# EAGLE design schematic (EAGLE 6.5.0)
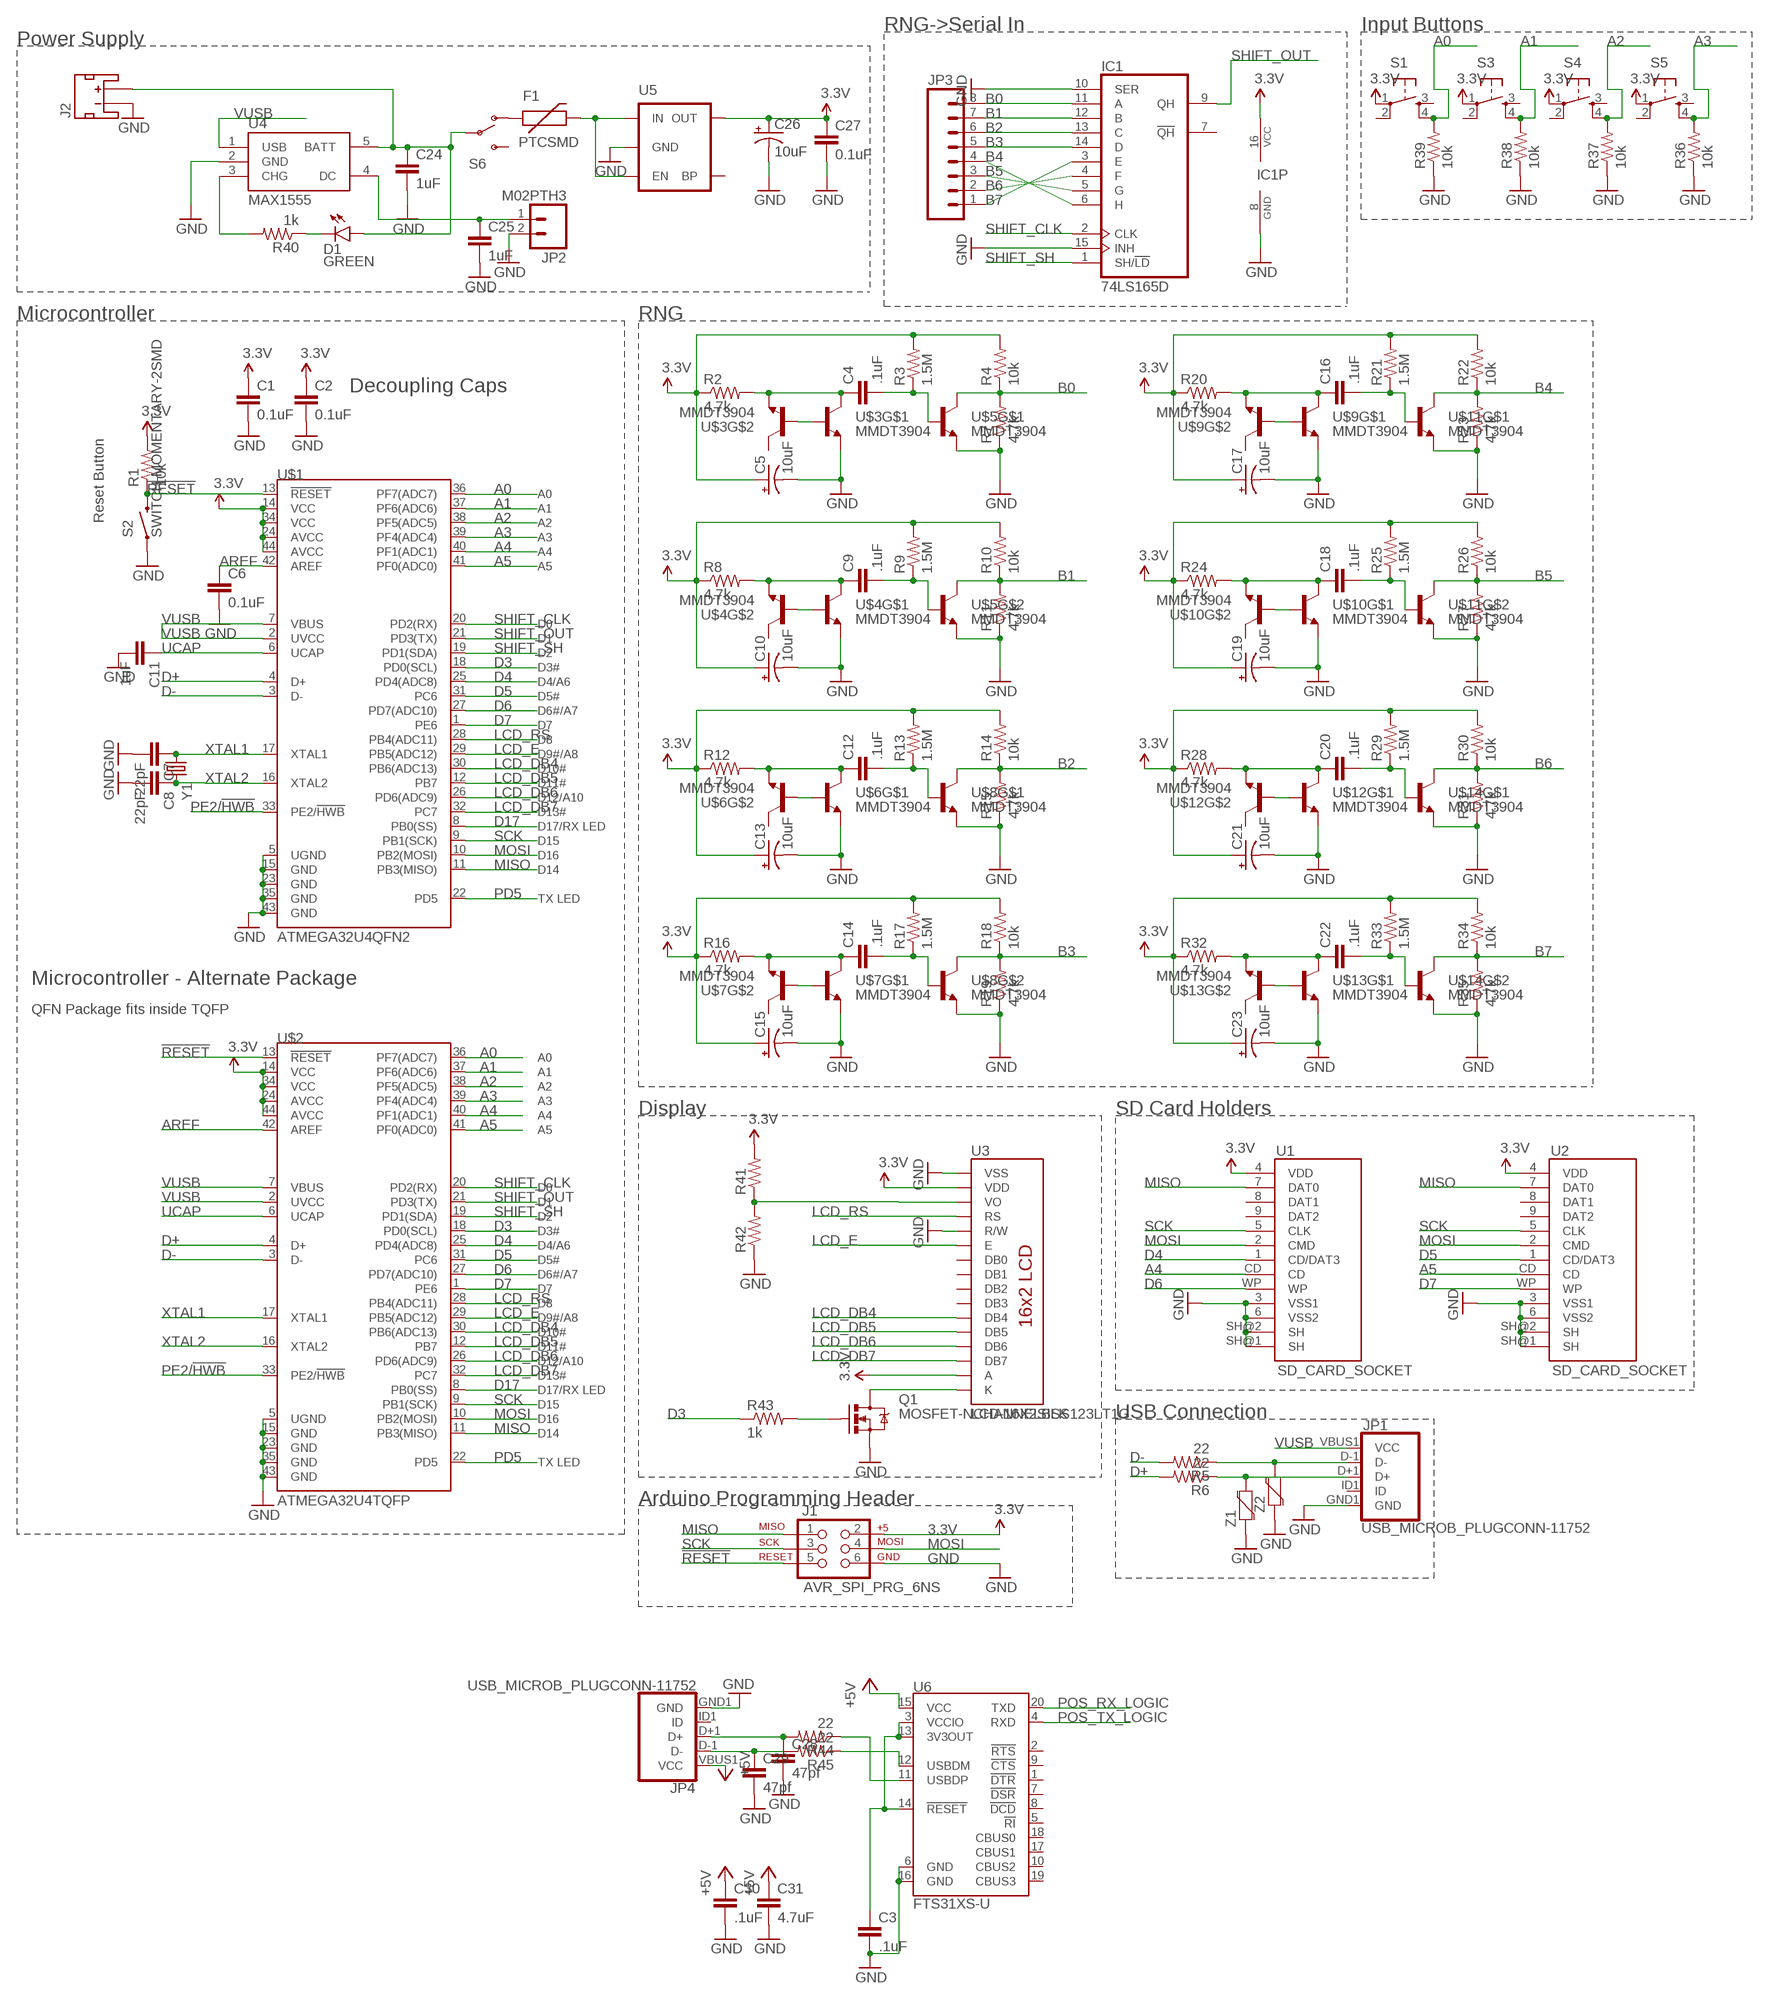
[diagram p0: schematic, sheet 1]

## Parts
C1  0.1uF  CAP0603-CAP  [0603-CAP]
C2  0.1uF  CAP0603-CAP  [0603-CAP]
C3  .1uF  CAP0603-CAP  [0603-CAP]
C4  .1uF  CAP0603-CAP  [0603-CAP]
C5  10uF  CAP_POL1206  [EIA3216]
C6  0.1uF  CAP0603-CAP  [0603-CAP]
C7  22pF  CAP0603-CAP  [0603-CAP]
C8  22pF  CAP0603-CAP  [0603-CAP]
C9  .1uF  CAP0603-CAP  [0603-CAP]
C10  10uF  CAP_POL1206  [EIA3216]
C11  1uF  CAP0603-CAP  [0603-CAP]
C12  .1uF  CAP0603-CAP  [0603-CAP]
C13  10uF  CAP_POL1206  [EIA3216]
C14  .1uF  CAP0603-CAP  [0603-CAP]
C15  10uF  CAP_POL1206  [EIA3216]
C16  .1uF  CAP0603-CAP  [0603-CAP]
C17  10uF  CAP_POL1206  [EIA3216]
C18  .1uF  CAP0603-CAP  [0603-CAP]
C19  10uF  CAP_POL1206  [EIA3216]
C20  .1uF  CAP0603-CAP  [0603-CAP]
C21  10uF  CAP_POL1206  [EIA3216]
C22  .1uF  CAP0603-CAP  [0603-CAP]
C23  10uF  CAP_POL1206  [EIA3216]
C24  1uF  CAP0603-CAP  [0603-CAP]
C25  1uF  CAP0603-CAP  [0603-CAP]
C26  10uF  CAP_POL1206  [EIA3216]
C27  0.1uF  CAP0603-CAP  [0603-CAP]
C28  47pf  CAP0603-CAP  [0603-CAP]
C29  47pf  CAP0603-CAP  [0603-CAP]
C30  .1uF  CAP0603-CAP  [0603-CAP]
C31  4.7uF  CAP0603-CAP  [0603-CAP]
D1  GREEN  LED-GREEN0603  [LED-0603]
F1  PTCSMD  [PTC-1206]
IC1  74LS165D  [SO16]
J1  AVR_SPI_PRG_6NS  [2X3-NS]
J2  JST_2MM_MALE  [JST-2-SMD]
JP1  USB_MICROB_PLUGCONN-11752  [USB-B-MICRO-SMD_V03]
JP2  M02PTH3  [1X02_LONGPADS]
JP3  M081X08  [1X08]
JP4  USB_MICROB_PLUGCONN-11752  [USB-B-MICRO-SMD_V03]
Q1  MOSFET-NCHANNELBSS123LT1G  [SOT23]
R1  10k  RESISTOR0603-RES  [0603-RES]
R2  4.7k  RESISTOR0603-RES  [0603-RES]
R3  1.5M  RESISTOR0603-RES  [0603-RES]
R4  10k  RESISTOR0603-RES  [0603-RES]
R5  22  RESISTOR0603-RES  [0603-RES]
R6  22  RESISTOR0603-RES  [0603-RES]
R7  4.7k  RESISTOR0603-RES  [0603-RES]
R8  4.7k  RESISTOR0603-RES  [0603-RES]
R9  1.5M  RESISTOR0603-RES  [0603-RES]
R10  10k  RESISTOR0603-RES  [0603-RES]
R11  4.7k  RESISTOR0603-RES  [0603-RES]
R12  4.7k  RESISTOR0603-RES  [0603-RES]
R13  1.5M  RESISTOR0603-RES  [0603-RES]
R14  10k  RESISTOR0603-RES  [0603-RES]
R15  4.7k  RESISTOR0603-RES  [0603-RES]
R16  4.7k  RESISTOR0603-RES  [0603-RES]
R17  1.5M  RESISTOR0603-RES  [0603-RES]
R18  10k  RESISTOR0603-RES  [0603-RES]
R19  4.7k  RESISTOR0603-RES  [0603-RES]
R20  4.7k  RESISTOR0603-RES  [0603-RES]
R21  1.5M  RESISTOR0603-RES  [0603-RES]
R22  10k  RESISTOR0603-RES  [0603-RES]
R23  4.7k  RESISTOR0603-RES  [0603-RES]
R24  4.7k  RESISTOR0603-RES  [0603-RES]
R25  1.5M  RESISTOR0603-RES  [0603-RES]
R26  10k  RESISTOR0603-RES  [0603-RES]
R27  4.7k  RESISTOR0603-RES  [0603-RES]
R28  4.7k  RESISTOR0603-RES  [0603-RES]
R29  1.5M  RESISTOR0603-RES  [0603-RES]
R30  10k  RESISTOR0603-RES  [0603-RES]
R31  4.7k  RESISTOR0603-RES  [0603-RES]
R32  4.7k  RESISTOR0603-RES  [0603-RES]
R33  1.5M  RESISTOR0603-RES  [0603-RES]
R34  10k  RESISTOR0603-RES  [0603-RES]
R35  4.7k  RESISTOR0603-RES  [0603-RES]
R36  10k  RESISTOR0603-RES  [0603-RES]
R37  10k  RESISTOR0603-RES  [0603-RES]
R38  10k  RESISTOR0603-RES  [0603-RES]
R39  10k  RESISTOR0603-RES  [0603-RES]
R40  1k  RESISTOR0603-RES  [0603-RES]
R41  RESISTOR0603-RES  [0603-RES]
R42  RESISTOR0603-RES  [0603-RES]
R43  1k  RESISTOR0603-RES  [0603-RES]
R44  22  RESISTOR0603-RES  [0603-RES]
R45  22  RESISTOR0603-RES  [0603-RES]
S1  TAC_SWITCHPTH  [TACTILE-PTH]
S2  SWITCH-MOMENTARY-2SMD  [TACTILE-SWITCH-SMD]
S3  TAC_SWITCHPTH  [TACTILE-PTH]
S4  TAC_SWITCHPTH  [TACTILE-PTH]
S5  TAC_SWITCHPTH  [TACTILE-PTH]
S6  SWITCH-SPDTPTH  [SWITCH-SPDT]
U1  SD_CARD_SOCKET  [SD_1:1]
U2  SD_CARD_SOCKET  [SD_1:1]
U3  LCD-16X2SILK  [LCD-16X2]
U4  MAX1555  [SOT23-5]
U5  MIC52053.3V  [SOT23-5]
U6  FTS31XS-U  FT231XS  [SSOP20_L]
U$1  ATMEGA32U4QFN2  [SPARKFUN-DIGITALIC_QFN-44-NOPAD]
U$2  ATMEGA32U4TQFP  [SPARKFUN-DIGITALIC_TQFP44]
U$3  MMDT3904  TRANSISTOR_NPN2UPMMDT3904  [SOT363]
U$4  MMDT3904  TRANSISTOR_NPN2UPMMDT3904  [SOT363]
U$5  MMDT3904  TRANSISTOR_NPN2UPMMDT3904  [SOT363]
U$6  MMDT3904  TRANSISTOR_NPN2UPMMDT3904  [SOT363]
U$7  MMDT3904  TRANSISTOR_NPN2UPMMDT3904  [SOT363]
U$8  MMDT3904  TRANSISTOR_NPN2UPMMDT3904  [SOT363]
U$9  MMDT3904  TRANSISTOR_NPN2UPMMDT3904  [SOT363]
U$10  MMDT3904  TRANSISTOR_NPN2UPMMDT3904  [SOT363]
U$11  MMDT3904  TRANSISTOR_NPN2UPMMDT3904  [SOT363]
U$12  MMDT3904  TRANSISTOR_NPN2UPMMDT3904  [SOT363]
U$13  MMDT3904  TRANSISTOR_NPN2UPMMDT3904  [SOT363]
U$14  MMDT3904  TRANSISTOR_NPN2UPMMDT3904  [SOT363]
Y1  CRYSTALSMD  [HC49UP]
Z1  VARISTOR-0603  [0603-RES]
Z2  VARISTOR-0603  [0603-RES]

## Nets
3.3V: C1.1 C2.1 C5.A(+) C10.A(+) C13.A(+) C15.A(+) C17.A(+) C19.A(+) C21.A(+) C23.A(+) C26.A(+) C27.1 IC1.16(VCC) J1.2 R1.2 R2.1 R3.2 R4.2 R8.1 R9.2 R10.2 R12.1 R13.2 R14.2 R16.1 R17.2 R18.2 R20.1 R21.2 R22.2 R24.1 R25.2 R26.2 R28.1 R29.2 R30.2 R32.1 R33.2 R34.2 R41.2 S1.1 S3.1 S4.1 S5.1 U1.4(VDD) U2.4(VDD) U3.2(VDD) U3.15(A) U5.5(OUT) U$1.14(VCC) U$1.24(AVCC) U$1.34(VCC) U$1.44(AVCC) U$2.14(VCC) U$2.24(AVCC) U$2.34(VCC) U$2.44(AVCC)
!RESET: J1.5 R1.1 S2.3 U$1.13(!RESET) U$2.13(!RESET)
+5V: C30.1 C31.1 JP4.VBUS1(VCC) U6.15(VCC)
A0: R39.2 S1.4 U$1.36(PF7(ADC7)) U$2.36(PF7(ADC7))
A1: R38.2 S3.4 U$1.37(PF6(ADC6)) U$2.37(PF6(ADC6))
A2: R37.2 S4.4 U$1.38(PF5(ADC5)) U$2.38(PF5(ADC5))
A3: R36.2 S5.4 U$1.39(PF4(ADC4)) U$2.39(PF4(ADC4))
A4: U1.CD U$1.40(PF1(ADC1)) U$2.40(PF1(ADC1))
A5: U2.CD U$1.41(PF0(ADC0)) U$2.41(PF0(ADC0))
AREF: C6.1 U$1.42(AREF) U$2.42(AREF)
B0: IC1.11(A) JP3.8 R4.1 R7.2 U$5.6(C)
B1: IC1.12(B) JP3.7 R10.1 R11.2 U$5.3(C)
B2: IC1.13(C) JP3.6 R14.1 R15.2 U$8.6(C)
B3: IC1.14(D) JP3.5 R18.1 R19.2 U$8.3(C)
B4: IC1.3(E) JP3.1 R22.1 R23.2 U$11.6(C)
B5: IC1.4(F) JP3.2 R26.1 R27.2 U$11.3(C)
B6: IC1.5(G) JP3.3 R30.1 R31.2 U$14.6(C)
B7: IC1.6(H) JP3.4 R34.1 R35.2 U$14.3(C)
D3: R43.1 U$1.18(PD0(SCL)) U$2.18(PD0(SCL))
D4: U1.1(CD/DAT3) U$1.25(PD4(ADC8)) U$2.25(PD4(ADC8))
D5: U2.1(CD/DAT3) U$1.31(PC6) U$2.31(PC6)
D6: U1.WP U$1.27(PD7(ADC10)) U$2.27(PD7(ADC10))
D7: U2.WP U$1.1(PE6) U$2.1(PE6)
D17: U$1.8(PB0(SS)) U$2.8(PB0(SS))
D+: R6.2 U$1.4(D+) U$2.4(D+)
D-: R5.2 U$1.3(D-) U$2.3(D-)
GND: C1.2 C2.2 C3.2 C5.C(-) C6.2 C7.2 C8.2 C10.C(-) C11.2 C13.C(-) C15.C(-) C17.C(-) C19.C(-) C21.C(-) C23.C(-) C24.2 C25.2 C26.C(-) C27.2 C28.2 C29.2 C30.2 C31.2 IC1.8(GND) IC1.10(SER) IC1.15(INH) J1.6 J2.1(-) JP1.GND1(GND) JP2.2 JP4.GND1(GND) Q1.2(S) R7.1 R11.1 R15.1 R19.1 R23.1 R27.1 R31.1 R35.1 R36.1 R37.1 R38.1 R39.1 R42.1 S2.1 U1.3(VSS1) U1.6(VSS2) U1.SH@1(SH) U1.SH@2(SH) U2.3(VSS1) U2.6(VSS2) U2.SH@1(SH) U2.SH@2(SH) U3.1(VSS) U3.5(R/W) U4.2(GND) U5.2(GND) U6.6(GND) U6.16(GND) U$1.5(UGND) U$1.15(GND) U$1.23(GND) U$1.35(GND) U$1.43(GND) U$2.5(UGND) U$2.15(GND) U$2.23(GND) U$2.35(GND) U$2.43(GND) U$3.1(E) U$4.1(E) U$5.1(E) U$5.4(E) U$6.1(E) U$7.1(E) U$8.1(E) U$8.4(E) U$9.1(E) U$10.1(E) U$11.1(E) U$11.4(E) U$12.1(E) U$13.1(E) U$14.1(E) U$14.4(E) Z1.1 Z2.1
LCD_DB4: U3.11(DB4) U$1.30(PB6(ADC13)) U$2.30(PB6(ADC13))
LCD_DB5: U3.12(DB5) U$1.12(PB7) U$2.12(PB7)
LCD_DB6: U3.13(DB6) U$1.26(PD6(ADC9)) U$2.26(PD6(ADC9))
LCD_DB7: U3.14(DB7) U$1.32(PC7) U$2.32(PC7)
LCD_E: U3.6(E) U$1.29(PB5(ADC12)) U$2.29(PB5(ADC12))
LCD_RS: U3.4(RS) U$1.28(PB4(ADC11)) U$2.28(PB4(ADC11))
MISO: J1.1 U1.7(DAT0) U2.7(DAT0) U$1.11(PB3(MISO)) U$2.11(PB3(MISO))
MOSI: J1.4 U1.2(CMD) U2.2(CMD) U$1.10(PB2(MOSI)) U$2.10(PB2(MOSI))
N$1: U$3.2(B) U$3.5(B)
N$2: C4.1 R2.2 U$3.4(E) U$3.6(C)
N$3: C24.1 D1.A J2.2(+) S6.2(P) U4.5(BATT)
N$4: C4.2 R3.1 U$5.2(B)
N$5: U$4.2(B) U$4.5(B)
N$6: C9.1 R8.2 U$4.4(E) U$4.6(C)
N$7: C9.2 R9.1 U$5.5(B)
N$8: C25.1 JP2.1 U4.4(DC)
N$9: U$6.2(B) U$6.5(B)
N$10: C12.1 R12.2 U$6.4(E) U$6.6(C)
N$11: C12.2 R13.1 U$8.2(B)
N$12: F1.1 S6.1(O)
N$13: U$7.2(B) U$7.5(B)
N$14: C14.1 R16.2 U$7.4(E) U$7.6(C)
N$15: C14.2 R17.1 U$8.5(B)
N$16: R40.2 U4.3(CHG)
N$17: U$9.2(B) U$9.5(B)
N$18: C16.1 R20.2 U$9.4(E) U$9.6(C)
N$19: C16.2 R21.1 U$11.2(B)
N$20: D1.C R40.1
N$21: Q1.1(G) R43.2
N$22: C28.1 JP4.D+1(D+) R44.2
N$23: C29.1 JP4.D-1(D-) R45.2
N$24: U$10.2(B) U$10.5(B)
N$25: C18.1 R24.2 U$10.4(E) U$10.6(C)
N$26: JP1.D-1(D-) R5.1 Z2.2
N$27: JP1.D+1(D+) R6.1 Z1.2
N$28: C18.2 R25.1 U$11.5(B)
N$29: Q1.3(D) U3.16(K)
N$30: U$12.2(B) U$12.5(B)
N$31: C20.1 R28.2 U$12.4(E) U$12.6(C)
N$32: C20.2 R29.1 U$14.2(B)
N$33: F1.2 U5.1(IN) U5.3(EN)
N$34: U$13.2(B) U$13.5(B)
N$35: C22.1 R32.2 U$13.4(E) U$13.6(C)
N$36: C22.2 R33.1 U$14.5(B)
N$37: R44.1 U6.11(USBDP)
N$38: R45.1 U6.12(USBDM)
N$39: R41.1 R42.2 U3.3(VO)
N$40: C3.1 U6.3(VCCIO) U6.13(3V3OUT) U6.14(!RESET)
PD5: U$1.22(PD5) U$2.22(PD5)
PE2/!HWB: U$1.33(PE2/!HWB) U$2.33(PE2/!HWB)
POS_RX_LOGIC: U6.20(TXD)
POS_TX_LOGIC: U6.4(RXD)
SCK: J1.3 U1.5(CLK) U2.5(CLK) U$1.9(PB1(SCK)) U$2.9(PB1(SCK))
SHIFT_CLK: IC1.2(CLK) U$1.20(PD2(RX)) U$2.20(PD2(RX))
SHIFT_OUT: IC1.9(QH) U$1.21(PD3(TX)) U$2.21(PD3(TX))
SHIFT_SH: IC1.1(SH/!LD) U$1.19(PD1(SDA)) U$2.19(PD1(SDA))
UCAP: C11.1 U$1.6(UCAP) U$2.6(UCAP)
VUSB: JP1.VBUS1(VCC) U4.1(USB) U$1.2(UVCC) U$1.7(VBUS) U$2.2(UVCC) U$2.7(VBUS)
XTAL1: C7.1 U$1.17(XTAL1) U$2.17(XTAL1) Y1.1
XTAL2: C8.1 U$1.16(XTAL2) U$2.16(XTAL2) Y1.2
Unconnected: IC1.7(!QH) J2.NC1(PAD1) J2.NC2(PAD2) JP1.ID1(ID) JP4.ID1(ID) S1.2 S1.3 S3.2 S3.3 S4.2 S4.3 S5.2 S5.3 S6.3(S) U1.8(DAT1) U1.9(DAT2) U2.8(DAT1) U2.9(DAT2) U3.7(DB0) U3.8(DB1) U3.9(DB2) U3.10(DB3) U5.4(BP) U6.1(!DTR) U6.2(!RTS) U6.5(!RI) U6.7(!DSR) U6.8(!DCD) U6.9(!CTS) U6.10(CBUS2) U6.17(CBUS1) U6.18(CBUS0) U6.19(CBUS3) U$3.3(C) U$4.3(C) U$6.3(C) U$7.3(C) U$9.3(C) U$10.3(C) U$12.3(C) U$13.3(C)

## Notes on the sheet
- RNG->Serial In | Input Buttons
- Power Supply
- Microcontroller | RNG
- Decoupling Caps
- Reset Button
- Microcontroller - Alternate Package
- QFN Package fits inside TQFP
- Display | SD Card Holders
- USB Connection
- Arduino Programming Header

## Library data of the parts
C1-C4 C6-C9 C11 C12 C14 C16 C18 C20 C22 C24 C25 C27-C31 = SparkFun-Passives:CAP: Capacitor Standard 0603 ceramic capacitor, and 0.1" leaded capacitor.
C5 C10 C13 C15 C17 C19 C21 C23 C26 = SparkFun-Passives:CAP_POL: Capacitor Polarized These are standard SMD and PTH capacitors. Normally 10uF, 47uF, and 100uF in electrolytic and tantalum varieties. Always verify the external diameter of the through hole cap, it varies with capacity, voltage, and manufacturer. The EIA devices should be standard.
D1 = SparkFun-LED:LED-GREEN: Various green LEDs Green LEDs used in SFE Production 0603- DIO-00821 LARGE- DIO-00862 LILYPAD- DIO-09910; PROD_ID: DIO-00821
F1 = SparkFun-PowerIC:PTC: Resettable Fuse PTC Resettable Fuse. Spark Fun Electronics SKU : COM-08357; PROD_ID: RES-11150
IC1 = 74xx-us:74*165: 8-bit parallel load SHIFT REGISTER
J1 = SparkFun-Connectors:AVR_SPI_PRG_6: AVR ISP 6 Pin This is the reduced ISP connector for AVR programming. Common on Arduino. This footprint will take up less PCB space and can be used with a 10-pin to 6-pin adapter such as SKU: BOB-08508
J2 = SparkFun-Connectors:JST_2MM_MALE: Mates to single-cell LiPo batteries. CONN-08352; PROD_ID: CONN-08352
JP1 JP4 = SparkFun-Connectors:USB_MICROB_PLUG: USB Micro-B connectors Some male, some female. Watch your step!; PROD_ID: CONN-11752
JP2 = SparkFun-Connectors:M02: Standard 2-pin 0.1" header. Use with - straight break away headers ( PRT-00116) - right angle break away headers (PRT-00553) - swiss pins (PRT-00743) - machine pins (PRT-00117) - female headers (PRT-00115) Molex polarized connector foot print use with: PRT-08233 with associated crimp pins and housings. 2.54_SCREWTERM for use with PRT-10571. 3.5mm Screw Terminal footprints for PRT-08084 5mm Screw Terminal footprints for use with PRT-08433
JP3 = SparkFun-Connectors:M08: Header 8 Standard 8-pin 0.1" header. Use with straight break away headers (SKU : PRT-00116), right angle break away headers (PRT-00553), swiss pins (PRT-00743), machine pins (PRT-00117), and female headers (PRT-00115).
Q1 = SparkFun-DiscreteSemi:MOSFET-NCHANNEL: Common NMOSFET Parts MFG P/N Store ID Prod ID FDD8780 TRANS-09984 SI7820DN TRANS-11055 FDS6630A IC-08089 2N7002PW TRANS-11151 FQP30N06L COM-10213 TRANS-10060 BSS123LT1G TRANS-08345 BSS138 TRANS-00830 BS170 2N7000; PROD_ID: TRANS-08345
R1-R45 = SparkFun-Passives:RESISTOR: Resistor Basic schematic elements and footprints for 0603, 1206, and PTH resistors.
S1 S3-S5 = SparkFun-Electromechanical:TAC_SWITCH: Momentary Switch Button commonly used for reset or general input. Spark Fun Electronics SKU : COM-00097 SMT- SWCH-08247
S2 = SparkFun-Electromechanical:SWITCH-MOMENTARY-2: Various NO switches- pushbuttons, reed, etc
S6 = SparkFun-Electromechanical:SWITCH-SPDT: SPDT Switch Simple slide switch, Spark Fun Electronics SKU : COM-00102 DPDT SMT slide switch, AYZ0202, SWCH-08179
U1 U2 = SparkFun-Connectors:SD_CARD_SOCKET: SD Memory Card Connector, push-push normal type, CD enable, WP enable
U3 = SparkFun-Displays:LCD-16X2: Standard text-only 16x2 parallel input LCD
U4 = SparkFun-PowerIC:MAX1555: MAX1555 Lithium Charger IC SOT-23 Lithium Polymer charging IC. Schematic element and footprint proven. Spark Fun Electronics SKU : COM-00674
U5 = SparkFun-PowerIC:MIC5205: MIC5205 150mA vreg 3.3V - VREG-00822 5V - VREG-00823; PROD_ID: VREG-00822
U6 = SparkFun-DigitalIC:FT231X: FTDI FT231X Full Speed USB to Full-handshake UART This USB2.0 Full Speed IC offers a compact bridge to full handshake UART interfaces. The device is a UART, capable of operating up to 3MBaud, with low power consumption (8mA). The FT231X includes the complete FT-X series feature set and enables USB to be added into a system design quickly and easily over a UART interface.; PROD_ID: IC-11524
U$1 = SparkFun-DigitalIC:ATMEGA32U4: Atmel 44-pin 8-bit Microcontroller with 32KBytes of ISP Flash and USB Controller ----- Please use the QFN-44-NOPAD_1:1 package for the footprint of all boards using a 32U4. Route traces directly away from the pads as much as possible.
U$2 = SparkFun-DigitalIC:ATMEGA32U4: Atmel 44-pin 8-bit Microcontroller with 32KBytes of ISP Flash and USB Controller ----- Please use the QFN-44-NOPAD_1:1 package for the footprint of all boards using a 32U4. Route traces directly away from the pads as much as possible.; PROD_ID: IC-11161
U$3-U$14 = SparkFun-DiscreteSemi:TRANSISTOR_NPN2UP: 2-up package of NPN transistors MMDT3904- TRANS-09373 (SOT-363, 200mA 40V); PROD_ID: TRANS-09373
Y1 = SparkFun-FreqCtrl:CRYSTAL: Various standard crystals. Proven footprints. Spark Fun Electronics SKU : COM-00534
Z1 Z2 = SparkFun-DiscreteSemi:VARISTOR: Varistor Varistor (Variable resistor) is a nonlinear resistive element of the voltage dependence that resistance changes with applied voltage. Varistor is equivalent with Zener diode of two series connection.

## Board
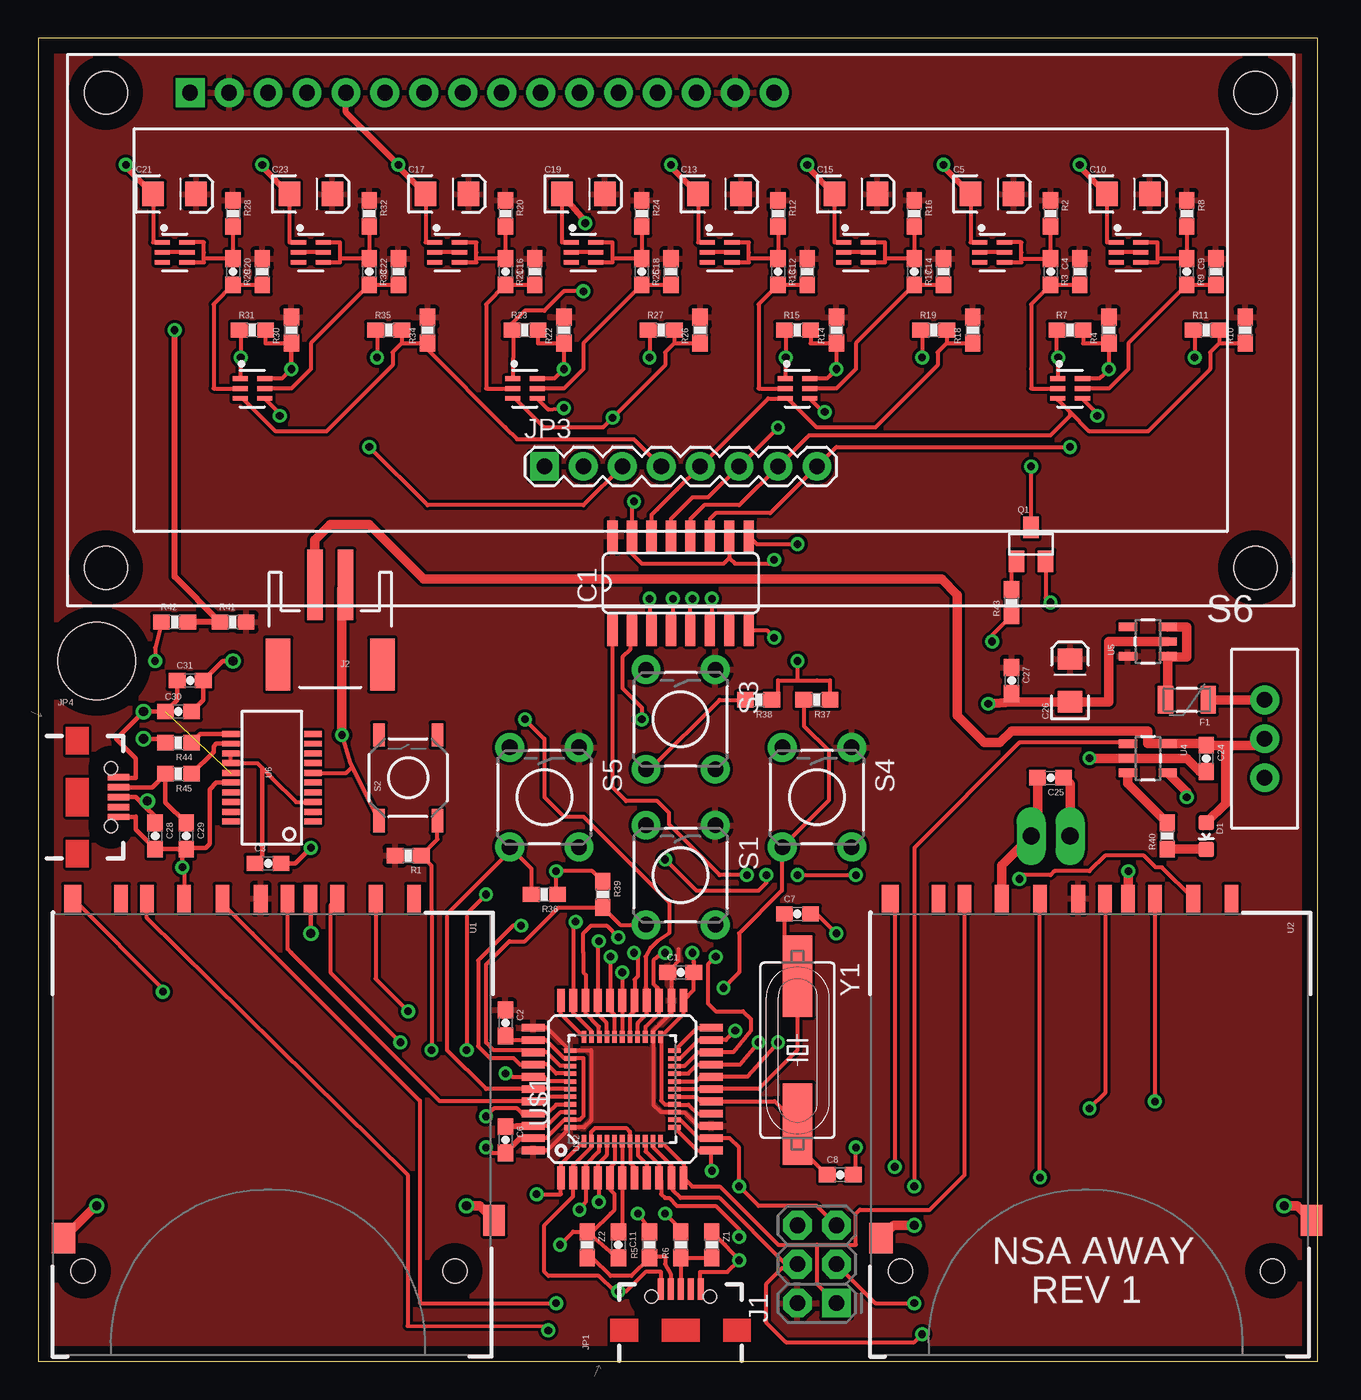
[diagram p1: board, top side]
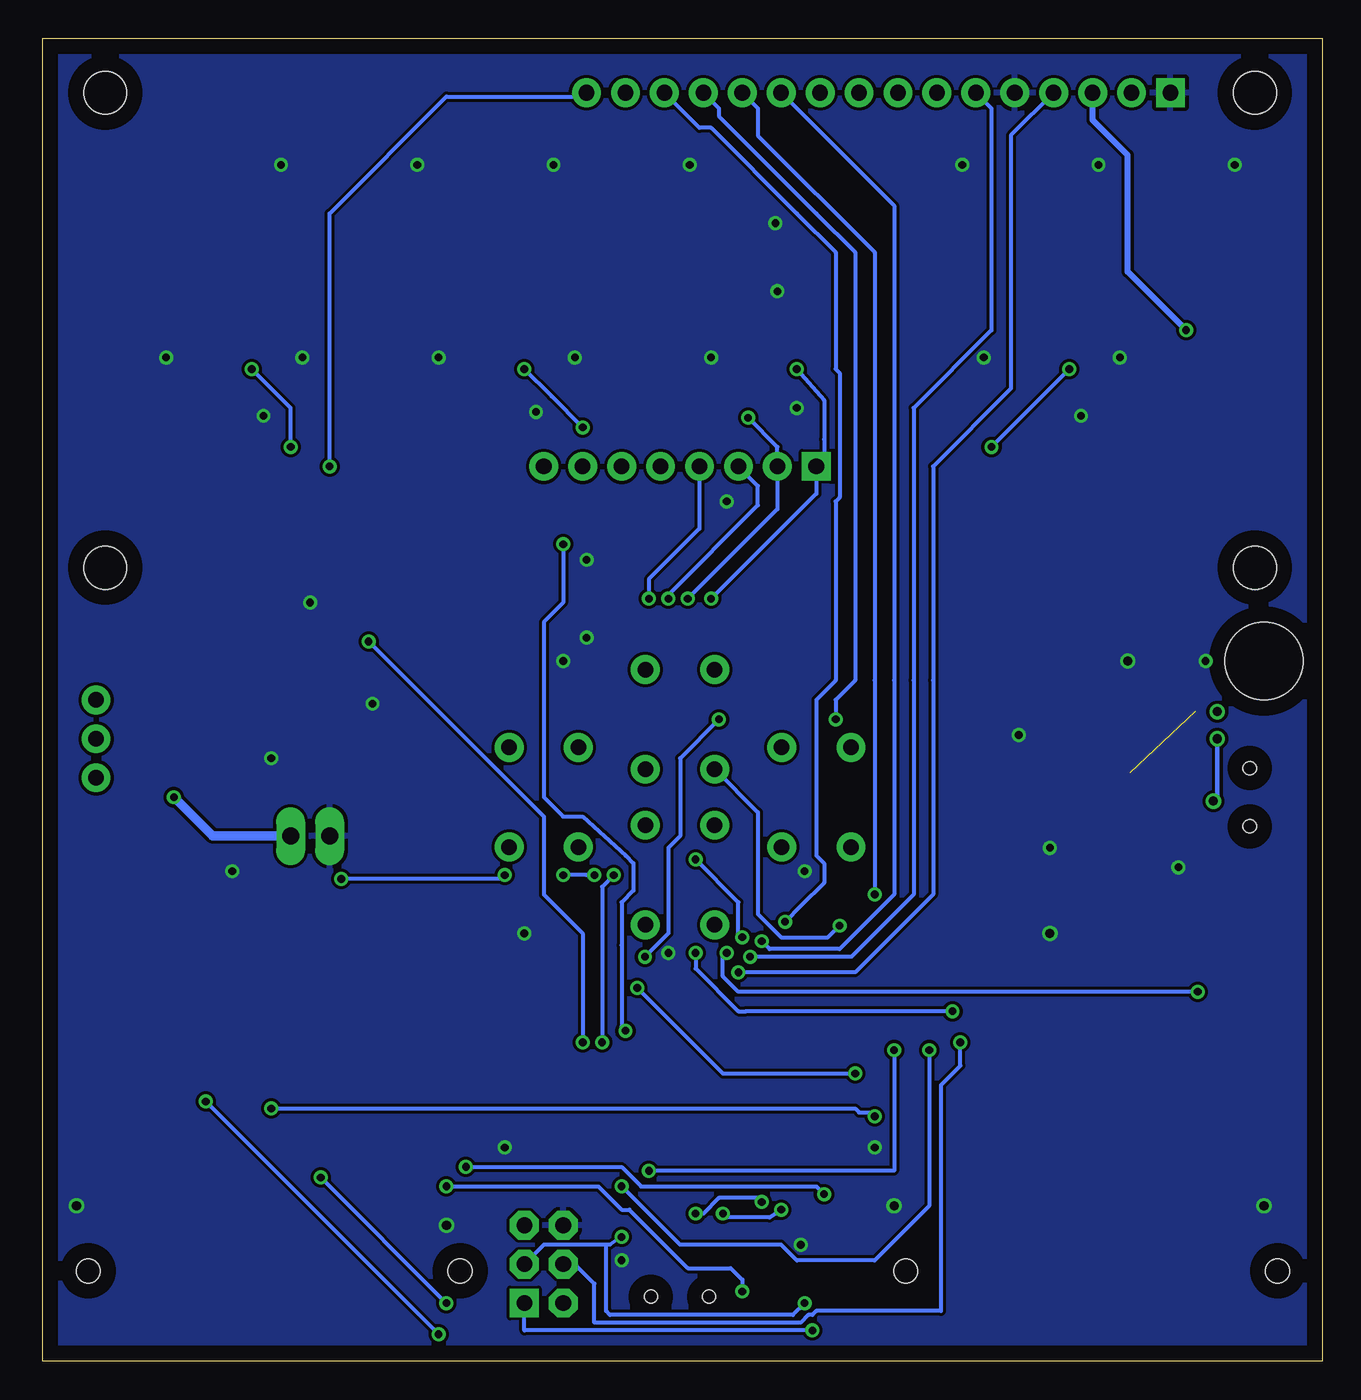
[diagram p2: board, bottom side, seen from below]

Size 83.49 x 86.34 mm. Coordinates in mm from the lower left corner, seen from the top.
Outline: 0,86.34 0,0 83.49,0 83.49,86.34 0,86.34
Copper layers (1*16): Top 0.035mm / dielectric 1.5mm / Bottom 0.035mm
Design rules: minimum track width 10mil, minimum drill 24mil, track to track 8mil, track to pad 8mil, pad to pad 8mil, via to via 8mil, smd to smd 8mil, copper to edge 40mil, drill to drill 8mil, minimum pad ring 10mil, minimum via ring 8mil, stop-mask expansion 4mil, vias tented up to drill 0mil, thermal gap 10mil
Holes 5.08 mm at 3.81,45.7

### Footprints (pad centres in the part's own frame; a part is rotated, then mirrored left to right if it is on the bottom)
0603-CAP = smd 1.1 x 1: 1 -0.85,0; 2 0.85,0
EIA3216 = smd 1.4 x 1.6: A 1.4,0; C -1.4,0
LED-0603 = smd 1 x 1: A 0,-0.877; C 0,0.877
PTC-1206 = smd 1 x 1.8: 1 -1.4,0; 2 1.4,0
SO16 = smd 0.66 x 2.032: 1 -4.445,-3.073; 2 -3.175,-3.073; 3 -1.905,-3.073; 4 -0.635,-3.073; 5 0.635,-3.073; 6 1.905,-3.073; 7 3.175,-3.073; 8 4.445,-3.073; 9 4.445,3.073; 10 3.175,3.073; 11 1.905,3.073; 12 0.635,3.073; 13 -0.635,3.073; 14 -1.905,3.073; 15 -3.175,3.073; 16 -4.445,3.073
2X3-NS = drill 1.016 pad 1.88 square: 1 -2.54,-1.27 | drill 1.016 pad 1.88 octagon: 2 -2.54,1.27; 3 0,-1.27; 4 0,1.27; 5 2.54,-1.27; 6 2.54,1.27
JST-2-SMD = smd 1 x 4.6: 1 -1,-3.7; 2 1,-3.7 | smd 1.6 x 3.4: NC1 -3.4,1.5; NC2 3.4,1.5
USB-B-MICRO-SMD_V03 = smd 1.4 x 0.4: D+1 2.7,0; D-1 2.7,0.65; GND1 2.7,-1.3; ID1 2.7,-0.65; VBUS1 2.7,1.3 | hole 0.85: 2.2,1.9; 2.2,-1.9
1X02_LONGPADS = drill 1.118 pad 1.88 long: 1 0,0; 2 2.54,0
1X08 = drill 1.016 pad 1.88 square: 1 0,0 | drill 1.016 pad 1.88: 2 2.54,0; 3 5.08,0; 4 7.62,0; 5 10.16,0; 6 12.7,0; 7 15.24,0; 8 17.78,0
SOT23 = smd 1 x 1.4: 1 -0.95,-1.1; 2 0.95,-1.1; 3 0,1.1
0603-RES = smd 1.1 x 1: 1 -0.85,0; 2 0.85,0
TACTILE-PTH = drill 1.016 pad 1.88: 1 -3.251,2.261; 2 3.251,2.261; 3 -3.251,-2.261; 4 3.251,-2.261
TACTILE-SWITCH-SMD = smd 1.524 x 0.762: 1 -2.794,1.905; 2 2.794,1.905; 3 -2.794,-1.905; 4 2.794,-1.905
SWITCH-SPDT = drill 1.016 pad 1.88: 1 0,2.54; 2 0,0; 3 0,-2.54
SD_1:1 = smd 1.8 x 0.9: 1 -1,6.77; 2 -1,4.27; 3 -1,2.52; 4 -1,-0.73; 5 -1,-3.23; 6 -1,-5.73; 7 -1,-8.15; 8 -1,-9.85; 9 -1,9.27; CD -1,1.02 | smd 2 x 1.4: SH@1 20,14.496 | smd 2 x 1.527: SH@2 21.15,-13.589 | smd 1.8 x 1.1: WP -1,-13 | hole 1.55: 23.3,11.94; 23.3,-12.32
LCD-16X2 = drill 1.016 pad 1.88 square: 1 -32,15.5 | drill 1.016 pad 1.88: 2 -29.46,15.5; 3 -26.92,15.5; 4 -24.38,15.5; 5 -21.84,15.5; 6 -19.3,15.5; 7 -16.76,15.5; 8 -14.22,15.5; 9 -11.68,15.5; 10 -9.14,15.5; 11 -6.6,15.5; 12 -4.06,15.5; 13 -1.52,15.5; 14 1.02,15.5; 15 3.56,15.5; 16 6.1,15.5 | hole 2.8: -37.5,15.5; -37.5,-15.5; 37.5,15.5; 37.5,-15.5
SOT23-5 = smd 0.55 x 1.2: 1 -0.95,-1.3; 2 0,-1.3; 3 0.95,-1.3; 4 0.95,1.3; 5 -0.95,1.3
SSOP20_L = smd 0.381 x 1.143: 1 -2.857,-2.68; 2 -2.223,-2.68; 3 -1.587,-2.68; 4 -0.953,-2.68; 5 -0.318,-2.68; 6 0.318,-2.68; 7 0.953,-2.68; 8 1.587,-2.68; 9 2.223,-2.68; 10 2.857,-2.68; 11 2.857,2.68; 12 2.223,2.68; 13 1.587,2.68; 14 0.953,2.68; 15 0.318,2.68; 16 -0.318,2.68; 17 -0.953,2.68; 18 -1.587,2.68; 19 -2.223,2.68; 20 -2.857,2.68
SPARKFUN-DIGITALIC_QFN-44-NOPAD = smd 0.8 x 0.3: 1 -3.4,2.5; 2 -3.4,2; 3 -3.4,1.5; 4 -3.4,1; 5 -3.4,0.5; 6 -3.4,0; 7 -3.4,-0.5; 8 -3.4,-1; 9 -3.4,-1.5; 10 -3.4,-2; 11 -3.4,-2.5; 23 3.4,-2.5; 24 3.4,-2; 25 3.4,-1.5; 26 3.4,-1; 27 3.4,-0.5; 28 3.4,0; 29 3.4,0.5; 30 3.4,1; 31 3.4,1.5; 32 3.4,2; 33 3.4,2.5 | smd 0.3 x 0.8: 12 -2.5,-3.4; 13 -2,-3.4; 14 -1.5,-3.4; 15 -1,-3.4; 16 -0.5,-3.4; 17 0,-3.4; 18 0.5,-3.4; 19 1,-3.4; 20 1.5,-3.4; 21 2,-3.4; 22 2.5,-3.4; 34 2.5,3.4; 35 2,3.4; 36 1.5,3.4; 37 1,3.4; 38 0.5,3.4; 39 0,3.4; 40 -0.5,3.4; 41 -1,3.4; 42 -1.5,3.4; 43 -2,3.4; 44 -2.5,3.4
SPARKFUN-DIGITALIC_TQFP44 = smd 1.5 x 0.5: 1 -5.8,4; 2 -5.8,3.2; 3 -5.8,2.4; 4 -5.8,1.6; 5 -5.8,0.8; 6 -5.8,0; 7 -5.8,-0.8; 8 -5.8,-1.6; 9 -5.8,-2.4; 10 -5.8,-3.2; 11 -5.8,-4; 23 5.8,-4; 24 5.8,-3.2; 25 5.8,-2.4; 26 5.8,-1.6; 27 5.8,-0.8; 28 5.8,0; 29 5.8,0.8; 30 5.8,1.6; 31 5.8,2.4; 32 5.8,3.2; 33 5.8,4 | smd 0.5 x 1.5: 12 -4,-5.8; 13 -3.2,-5.8; 14 -2.4,-5.8; 15 -1.6,-5.8; 16 -0.8,-5.8; 17 0,-5.8; 18 0.8,-5.8; 19 1.6,-5.8; 20 2.4,-5.8; 21 3.2,-5.8; 22 4,-5.8; 34 4,5.8; 35 3.2,5.8; 36 2.4,5.8; 37 1.6,5.8; 38 0.8,5.8; 39 0,5.8; 40 -0.8,5.8; 41 -1.6,5.8; 42 -2.4,5.8; 43 -3.2,5.8; 44 -4,5.8
SOT363 = smd 0.3 x 0.99: 1 -0.65,-0.8; 2 0,-0.8; 3 0.65,-0.8; 4 0.65,0.81; 5 0,0.81; 6 -0.65,0.81
HC49UP = smd 5.334 x 1.93: 1 -4.826,0; 2 4.826,0

### Placement (x,y rotation side)
C1  41.91,25.38 0 top
C2  30.48,22.08 270 top
C3  14.99,32.49 0 top
C4  66.04,71.1 270 top
C5  62.23,76.18 0 top
C6  30.48,14.46 270 top
C7  49.53,29.19 0 top
C8  52.32,12.17 0 top
C9  74.93,71.1 270 top
C10  71.12,76.18 0 top
C11  37.85,7.6 270 top
C12  48.26,71.1 270 top
C13  44.45,76.18 0 top
C14  57.15,71.1 270 top
C15  53.34,76.18 0 top
C16  30.48,71.1 270 top
C17  26.67,76.18 0 top
C18  39.37,71.1 270 top
C19  35.56,76.18 0 top
C20  12.7,71.1 270 top
C21  8.89,76.18 0 top
C22  21.59,71.1 270 top
C23  17.78,76.18 0 top
C24  76.2,39.35 270 top
C25  66.04,38.08 180 top
C26  67.31,44.43 90 top
C27  63.5,44.43 270 top
C28  7.62,34.27 270 top
C29  9.65,34.27 270 top
C30  9.14,42.4 0 top
C31  9.91,44.43 0 top
D1  76.2,34.27 180 top
F1  74.93,43.16 180 top
IC1  41.91,50.78 0 top
J1  50.8,6.33 90 top
J2  19.05,46.97 180 top
JP1  41.91,2.01 90 top
JP2  67.31,34.27 180 top
JP3  33.02,58.4 0 top
JP4  2.54,36.81 0 top
Q1  64.77,53.32 0 top
R1  24.13,33 180 top
R2  66.04,74.91 270 top
R3  67.94,71.1 90 top
R4  69.85,67.29 90 top
R5  39.88,7.6 90 top
R6  41.91,7.6 90 top
R7  67.31,67.29 0 top
R8  74.93,74.91 270 top
R9  76.83,71.1 90 top
R10  78.74,67.29 90 top
R11  76.2,67.29 0 top
R12  48.26,74.91 270 top
R13  50.16,71.1 90 top
R14  52.07,67.29 90 top
R15  49.53,67.29 0 top
R16  57.15,74.91 270 top
R17  59.05,71.1 90 top
R18  60.96,67.29 90 top
R19  58.42,67.29 0 top
R20  30.48,74.91 270 top
R21  32.38,71.1 90 top
R22  34.29,67.29 90 top
R23  31.75,67.29 0 top
R24  39.37,74.91 270 top
R25  41.27,71.1 90 top
R26  43.18,67.29 90 top
R27  40.64,67.29 0 top
R28  12.7,74.91 270 top
R29  14.61,71.1 90 top
R30  16.51,67.29 90 top
R31  13.97,67.29 0 top
R32  21.59,74.91 270 top
R33  23.5,71.1 90 top
R34  25.4,67.29 90 top
R35  22.86,67.29 0 top
R36  33.02,30.46 180 top
R37  50.8,43.16 180 top
R38  46.99,43.16 180 top
R39  36.83,30.46 270 top
R40  73.66,34.27 90 top
R41  12.7,48.24 0 top
R42  8.89,48.24 0 top
R43  63.5,49.51 90 top
R44  9.14,40.37 180 top
R45  9.14,38.33 180 top
S1  41.91,31.73 270 top
S2  24.13,38.08 90 top
S3  41.91,41.89 270 top
S4  50.8,36.81 270 top
S5  33.02,36.81 270 top
S6  80.01,40.62 0 top
U1  15.24,29.19 270 top
U2  68.58,29.19 270 top
U3  41.91,67.29 0 top
U4  72.39,39.35 270 top
U5  72.39,46.97 90 top
U6  15.24,38.08 90 top
U$1  38.1,17.76 90 top
U$2  38.1,17.76 90 top
U$3  62.23,72.37 270 top
U$4  71.12,72.37 270 top
U$5  67.31,63.48 270 top
U$6  44.45,72.37 270 top
U$7  53.34,72.37 270 top
U$8  49.53,63.48 270 top
U$9  26.67,72.37 270 top
U$10  35.56,72.37 270 top
U$11  31.75,63.48 270 top
U$12  8.89,72.37 270 top
U$13  17.78,72.37 270 top
U$14  13.97,63.48 270 top
Y1  49.53,20.3 270 top
Z1  43.94,7.6 270 top
Z2  35.81,7.6 270 top

### Tracks (layer width: path | path; a pad name or v marks a point on that pad's centre or on a via)
3.3V
  Top 0.254: U$2.44 33.2,13.76 U$1.44 35.6,15.26 36.07,15.73 36.07,20.3 35.31,20.3 34.74,20.3 U$1.34 33.2,21.76 U$2.34 | U$2.14 43.04,15.36 42.16,16.24 41.52,16.24 U$1.14 40.62,16.26 40.13,16.74 40.13,21.13 U$1.24 40.13,21.19 40.13,21.57 41.3,22.74 U$2.24 41.3,25.14 C1.1 | 41.15,25.38 41.78,26.14 41.78,26.9
  pour Top: 0,86.34 0,-0.02 83.82,-0.02 83.82,86.34
!RESET  (via drill 0.5)
  Top 0.254: U$1.13 41.53,15.73 41.91,15.73 43.08,14.56 U$2.13 45.11,14.56 45.72,13.95 v45.72,11.41 46.99,10.14 50.8,10.14 J1.5 | S2.3 26.04,34.05 R1.1 25.65,32.33 25.65,29.44 v25.65,20.3
  Bottom 0.254: v25.65,20.3 25.65,10.14 29.21,6.58 34.29,6.58 35.31,7.6 37.08,7.6 41.91,7.6 v45.72,11.41
+5V  (via drill 0.6)  (1 unrouted)
  Top 0.305: JP4.VBUS1 5.27,38.08 6.35,38.08 6.35,39.35 5.08,40.62 6.35,41.89 v6.86,42.4 C30.1 | 8.13,42.4 C30.1 | C30.1 9.06,43.16 C31.1
A0
  Top 0.254: U$1.36 34.68,19.28 34.04,19.28 33.16,20.16 | 33.16,20.16 U$2.36 | S1.4 37.96,28.48 R39.2 33.95,29.61 31.75,27.41 30.73,27.41 29.21,25.89 29.21,20.81 29.72,20.3 32.77,20.3 33.16,20.16
A1  (via drill 0.5)
  Top 0.254: U$1.37 34.68,18.78 33.78,18.78 33.2,19.36 U$2.37 31.42,19.36 31.24,19.54 30.99,19.79 29.46,19.79 28.7,20.55 28.7,26.14 30.99,28.43 v31.5,28.43 | S3.4 39.93,38.64 44.45,43.16 R38.2
  Bottom 0.254: S3.4 36.83,35.82 36.83,31.73 36.83,29.19 35.31,27.67 32.26,27.67 v31.5,28.43
A2  (via drill 0.5)
  Top 0.254: U$1.38 33.27,18.27 32.98,18.56 U$2.38 30.95,18.56 v30.48,18.78 | R37.2 49.95,41.47 51.56,39.86 51.56,36.58 S4.4 48.51,33.53 48.51,32.24 48.51,30.71 45.72,27.92 45.72,25.38 v44.7,24.36
  Bottom 0.254: v44.7,24.36 39.12,18.78 v30.48,18.78
A3
  Top 0.254: U$1.39 U$2.39 29.21,17.76 26.67,20.3 26.67,29.19 30.76,33.28 S5.4 32.17,32.15 R36.2
A4
  Top 0.254: U$1.40 33.27,17.25 32.98,16.96 U$2.40 26.2,16.96 16.51,26.65 16.26,26.9 U1.CD
A5  (via drill 0.5)
  Top 0.254: U$1.41 34.68,16.74 33.78,16.74 33.2,16.16 U$2.41 31.57,16.16 31.24,16.49 29.72,16.49 v29.21,15.98 | U2.CD 69.6,17.51 v68.58,16.49
  Bottom 0.254: v68.58,16.49 30.48,16.49 30.23,16.24 29.46,16.24 v29.21,15.98
AREF
  Top 0.254: U$1.42 34.68,16.24 34.04,16.24 33.16,15.36 U$2.42
  Top 0.406: C6.1 31.19,15.36 U$2.42
B0  (via drill 0.5)
  Top 0.254: R7.2 68.16,66.44 R4.1 v69.85,64.75 | v69.85,64.75 69.34,64.24 | 69.34,64.24 69.23,64.13 U$5.6 | IC1.11 43.81,54.97 44.2,55.35 47.75,55.35 JP3.8 52.07,59.67 v67.31,59.67 | v69.85,64.75 69.34,64.24
  Bottom 0.254: v67.31,59.67 67.31,62.21 v69.85,64.75
B1
  Top 0.254: R11.2 77.05,66.44 | 77.05,66.44 R10.1 | 77.05,66.44 76.45,65.84 76.45,64.75 72.39,60.69 68.58,60.69 67.31,61.96 | 67.31,61.96 66.51,62.76 U$5.3 | IC1.12 42.55,54.97 43.43,55.86 45.72,55.86 JP3.7 50.29,60.43 66.04,60.43 67.31,61.7 67.31,61.96
B2  (via drill 0.5)
  Top 0.254: R15.2 50.38,66.44 R14.1 v52.07,64.75 | v52.07,64.75 51.69,64.37 | 51.69,64.37 51.45,64.13 U$8.6 | IC1.13 41.27,54.97 42.67,56.37 43.69,56.37 JP3.6 v48.26,60.94 | v52.07,64.75 51.69,64.37
  Bottom 0.254: v48.26,60.94 50.29,62.97 v52.07,64.75
B3
  Top 0.254: R19.2 59.27,66.44 | 59.27,66.44 R18.1 | 59.27,66.44 58.67,65.84 58.67,65 54.61,60.94 50.8,60.94 48.91,62.83 U$8.3 47.61,62.83 JP3.5 41.66,56.88 40.39,55.61 40.01,55.22 IC1.14
B4  (via drill 0.5)
  Top 0.254: R23.2 32.6,66.44 R22.1 v34.29,64.75 33.67,64.13 U$11.6 | v39.88,49.76 39.88,47.83 IC1.3
  Bottom 0.254: v39.88,49.76 33.02,56.62 JP3.1 32.51,58.91 32.51,60.18 32.51,62.72 v34.29,64.75
B5  (via drill 0.5)
  Top 0.254: R27.2 41.49,66.44 | 41.49,66.44 R26.1 | 41.49,66.44 40.89,65.84 40.89,65 38.1,62.21 | 38.1,62.21 v37.47,61.57 | v37.47,61.57 36.83,60.94 33.02,60.94 31.13,62.83 U$11.3 | v37.47,61.57 38.1,62.21 | v41.4,49.76 41.4,47.83 IC1.4
  Bottom 0.254: v37.47,61.57 35.56,59.67 JP3.2 35.56,55.61 v41.4,49.76
B6  (via drill 0.5)
  Top 0.254: R31.2 14.82,66.44 R30.1 | R30.1 v16.51,64.75 | v16.51,64.75 15.89,64.13 U$14.6 | JP3.3 35.56,55.86 25.4,55.86 v21.59,59.67 | v16.51,64.75 R30.1 | IC1.5 42.55,49.64 v42.67,49.76
  Bottom 0.254: v21.59,59.67 v16.51,64.75 | v42.67,49.76 42.67,50.02 36.83,55.86 36.83,57.13 JP3.3
B7  (via drill 0.5)
  Top 0.254: R35.2 23.71,66.44 | 23.71,66.44 R34.1 25.4,66.02 30.48,60.94 31.24,60.18 38.86,60.18 JP3.4 | 23.71,66.44 23.11,65.84 23.11,65 18.8,60.69 15.49,60.69 13.35,62.83 U$14.3 | v43.94,49.76 43.94,47.83 IC1.6
  Bottom 0.254: JP3.4 40.64,54.34 43.94,51.03 v43.94,49.76
D3  (via drill 0.5)
  Top 0.254: U$1.18 42.93,18.27 43.22,18.56 U$2.18 46.27,18.56 v48.26,20.81 | R43.1 62.23,47.39 v62.23,46.97
  Bottom 0.254: v62.23,46.97 50.8,35.54 50.8,30.46 48.26,27.92 v48.26,20.81
D4  (via drill 0.5)
  Top 0.254: U$1.25 39.62,21.18 39.62,21.82 40.5,22.7 U$2.25 40.5,24.25 40.39,24.36 40.13,24.62 40.13,26.14 40.39,26.4 v40.89,26.65 | U1.1 22.01,24.96 v24.13,22.84
  Bottom 0.254: v24.13,22.84 37.59,22.84 38.1,22.84 40.89,25.63 v40.89,26.65
D5  (via drill 0.5)
  Top 0.254: U$1.31 36.58,21.18 36.58,21.82 35.7,22.7 U$2.31 35.7,25.24 35.56,25.38 35.56,26.65 35.56,27.92 36.07,28.43 37.08,28.43 v37.85,27.67 | U2.1 73.3,32.24 72.9,32.24 72.14,33 69.6,33 68.58,31.98 66.29,31.98 66.04,31.73 64.26,31.73 v64.01,31.48 | v40.89,32.75 42.93,30.71 46.99,30.71 47.5,31.22 v47.5,31.73 | v49.53,31.73 v53.34,31.73
  Bottom 0.254: v37.85,27.67 38.1,27.92 38.1,29.95 v40.89,32.75 | v47.5,31.73 48.01,31.73 v49.53,31.73 | v53.34,31.73 53.59,31.48 v64.01,31.48
D6  (via drill 0.5)
  Top 0.254: U$1.27 38.61,22.59 38.9,22.88 U$2.27 38.9,24.91 39.12,25.13 39.12,26.4 v38.86,26.65 | U1.WP 8.32,24.11 v8.13,24.11
  Bottom 0.254: v8.13,24.11 38.1,24.11 39.12,25.13 39.12,26.4 v38.86,26.65
D7  (via drill 0.5)
  Top 0.254: U$1.1 34.1,12.86 U$2.1 34.1,10.9 v32.51,10.9 | U2.WP 55.88,29.89 v55.88,12.68
  Bottom 0.254: v55.88,12.68 45.72,12.68 44.45,11.41 33.02,11.41 v32.51,10.9
D17
  Top 0.254: U$1.8 39.12,14.34 39.12,13.44 39.7,12.86 U$2.8
D+  (via drill 0.5)
  Top 0.254: U$1.4 37.08,14.34 37.08,13.44 36.5,12.86 U$2.4 36.58,11.88 v36.58,10.39 | v40.89,9.63 41.91,8.62 R6.2
  Bottom 0.254: v36.58,10.39 36.83,10.65 39.37,10.65 40.39,9.63 v40.89,9.63
D-  (via drill 0.5)
  Top 0.254: U$1.3 36.58,14.34 36.58,13.7 35.7,12.82 U$2.3 35.7,10.39 v35.31,9.89 | v39.12,9.63 39.88,8.62 R5.2
  Bottom 0.254: v35.31,9.89 36.07,9.38 38.86,9.38 v39.12,9.63
GND  (via drill 0.5, 0.6)
  Top 0.254: C5.C 60.83,73.02 U$3.1 | C10.C 69.72,73.02 U$4.1 | C15.C 51.94,73.02 U$7.1 | C13.C 43.05,73.02 U$6.1 | C19.C 34.16,73.02 U$10.1 | C17.C 25.27,73.02 U$9.1 | C23.C 16.38,73.02 U$13.1 | C21.C 7.49,73.02 U$12.1 | U$2.43 33.12,14.56 34.29,15.73 34.67,15.73 U$1.43 35.34,15.76 35.56,15.98 35.56,19.79 34.73,19.79 U$1.35 34.67,19.79 34.29,19.79 33.12,20.96 U$2.35 30.75,20.96 C2.2 | U$1.5 37.59,12.93 37.3,12.64 U$2.5 | U$2.15 43,16.16 42.42,16.74 41.52,16.74 U$1.15 40.88,16.76 40.64,17 40.64,21.12 U$1.23 42.1,22.66 U$2.23 42.76,24.22 C1.2 42.76,26.05 v42.67,26.65 | R31.1 13.21,67.2 v13.21,65.51 13.21,64.17 U$14.1 | U$11.1 30.99,64.17 30.99,65.51 30.99,67.2 R23.1 30.9,67.71 31.75,68.56 33.02,68.56 34.29,69.83 v35.56,69.83 | R15.1 48.77,67.2 v48.77,65.51 48.77,64.17 U$8.1 | R7.1 66.46,65.6 v66.55,65.51 66.55,64.17 U$5.1 | R35.1 22.1,67.2 v22.1,65.51 | R27.1 39.88,67.2 v39.88,65.51 | R11.1 75.44,67.2 v75.44,65.51 | R19.1 57.66,67.2 v57.66,65.51 | U$14.4 15.75,61.86 v15.75,61.7 | U$11.4 33.27,62.12 v34.29,62.21 | U$8.4 51.31,61.86 v51.31,61.96 | U$5.4 69.09,61.86 v69.09,61.7 | v38.86,56.11 38.73,55.99 IC1.15 38.73,52.68 39.37,52.05 44.7,52.05 45.09,52.43 | IC1.10 45.09,52.43 | 45.09,52.43 45.47,52.05 47.75,52.05 v48.01,52.3 | IC1.8 47.52,47.71 v48.01,47.22 | Q1.2 65.72,49.83 v66.04,49.51 | C7.2 50.8,29.19 v52.07,27.92 | C8.2 53.34,12.43 v53.34,13.95 | Z1.1 44.79,7.6 v45.72,6.58 44.96,5.82 43.18,5.82 43.18,4.71 JP1.GND1 | v9.4,32.24 9.51,32.13 U1.6 | v19.81,40.87 20.32,39.1 20.47,38.79 | 20.47,38.79 S2.1 | R36.1 33.78,30.55 v33.78,31.98 36.16,31.98 R39.1 | R38.1 48.26,43.58 48.26,44.43 49.53,44.43
  Top 0.254: 49.53,44.43 50.8,44.43 51.65,44.43 R37.1 | v49.53,45.7 49.53,44.43 | v34.04,7.6 34.89,8.45 Z2.1 | U$2.5 37.34,11.92 | Z2.1 36.16,8.45 37.34,9.63 37.59,9.89 37.59,10.65 37.59,10.9 37.34,11.16 37.34,11.92 | Z2.1 37.77,6.75 C11.2 | v29.21,13.95 29.63,13.61 C6.2 | R42.1 7.62,46.55 v7.62,45.7 | 37.34,11.92 U$2.5 | U6.6 20.08,38.4 20.47,38.79
  Top 0.305: 9.4,33.17 C29.2 9.74,33.51 10.92,33.51 11.18,33.76 11.18,37.32 11.62,37.76 U6.16 | 9.4,33.17 v9.4,32.24 | 9.4,33.17 9.14,33.42 C28.2 6.35,34.69 6.35,35.54 6.32,35.51 JP4.GND1 | C30.2 10.76,43.16 C31.2 12.03,45.7 v12.7,45.7 | C3.2 16.76,32.49 v17.78,33.51 | U1.3 17.76,27.94 v17.78,27.92
  Top 0.406: v5.71,78.09 5.71,77.95 C21.C | v14.61,78.09 14.61,77.95 C23.C | C17.C 23.5,77.95 v23.5,78.09 20.07,81.51 U3.5 | v35.69,74.28 35.69,74.4 C19.C | v41.27,78.09 41.27,77.95 C13.C | v50.16,78.09 50.16,77.95 C15.C | v59.05,78.09 59.05,77.95 C5.C | v67.94,78.09 67.94,77.95 C10.C | C6.2 31.43,14.56 U$2.43
  Top 0.61: C25.2 65.19,34.69 JP2.2 62.85,32.35 U2.6 | C24.2 75.78,38.5 74.93,39.35 U4.2 v68.58,39.35 | U5.2 69.85,46.97 69.85,43.03 C26.C 63.5,43.03 | C27.2 63.5,43.03 | v61.98,42.91 63.5,43.03 | U2.3 71.12,30.21 v71.12,31.98 | J2.1 19.81,50.43 v19.81,40.87 | U2.SH@1 82.13,10.14 v81.28,10.14 | U1.SH@1 28.79,10.14 v27.94,10.14 | U1.SH@2 3.75,10.14 v3.81,10.14 | U2.SH@2 55.82,8.87 v57.15,8.87
  pour Bottom: 0,86.34 0,-0.02 83.82,-0.02 83.82,86.34
LCD_DB4  (via drill 0.5)
  Top 0.254: U$1.30 37.08,21.18 37.08,22.08 36.5,22.66 U$2.30 36.5,27.34 v36.58,27.41
  Bottom 0.254: U3.11 27.94,75.42 27.94,44.43 27.94,30.46 30.99,27.41 31.5,26.9 36.07,26.9 v36.58,27.41
LCD_DB5  (via drill 0.5)
  Top 0.254: U$1.12 43,13.76 U$2.12 43.9,12.47 v43.94,12.43 | v29.21,30.46 27.94,29.19 v27.94,20.3
  Bottom 0.254: U3.12 36.83,81.77 36.83,79.99 29.21,72.37 29.21,44.43 v29.21,30.46 | v43.94,12.43 35.81,12.43 27.94,12.43 v27.94,20.3
LCD_DB6  (via drill 0.5)
  Top 0.254: U$1.26 39.12,21.18 39.12,22.08 39.7,22.66 U$2.26 39.7,24.29 39.62,24.36 39.62,26.4 39.95,26.98 40.39,27.41 41.15,27.92 41.15,29.95 35.56,35.54 34.29,35.54 33.02,36.81 33.02,40.62 v31.75,41.89
  Bottom 0.254: U3.13 39.37,81.77 39.37,81.26 33.02,74.91 30.48,72.37 30.48,44.43 31.75,43.16 v31.75,41.89
LCD_DB7  (via drill 0.5)
  Top 0.254: U$1.32 36.07,21.19 36.07,21.57 34.9,22.74 U$2.32 34.9,28.58 35.05,28.73 v35.05,28.68
  Bottom 0.254: U3.14 40.64,80.5 39.88,80.5 34.29,74.91 31.75,72.37 31.75,64.75 31.5,64.5 31.5,56.37 31.75,56.11 31.75,44.43 33.02,43.16 33.02,33 32.51,32.49 32.51,31.22 34.04,29.7 v35.05,28.68
LCD_E  (via drill 0.5)
  Top 0.254: U$1.29 37.59,22.59 37.3,22.88 U$2.29 37.3,26.36 v37.34,26.4
  Bottom 0.254: U3.6 21.59,81.77 21.59,67.29 26.67,62.21 26.67,44.43 26.67,30.46 30.73,26.4 v37.34,26.4
LCD_RS  (via drill 0.5)
  Top 0.254: U$1.28 U$2.28 v38.1,25.38
  Bottom 0.254: U3.4 20.32,80 20.32,63.48 25.4,58.4 25.4,44.43 25.4,30.46 30.48,25.38 v38.1,25.38
MISO  (via drill 0.5)
  Top 0.254: U$1.11 42.1,12.86 U$2.11 42.65,11.41 44.45,11.41 48.26,7.6 50.8,7.6 | 50.8,7.6 50.8,5.06 J1.1 | v33.27,2.01 33.02,2.27 24.09,2.3 24.09,12.17 7.09,28.92 U1.7 | 50.8,7.6 53.34,7.6 53.34,9.63 53.59,9.89 58.17,9.89 60.43,12.15 U2.7
  Bottom 0.254: v33.27,2.01 52.07,2.01 J1.1
MOSI  (via drill 0.5)
  Top 0.254: U$1.10 40.13,14.33 40.13,13.95 41.3,12.78 U$2.10 | U$2.10 41.4,11.86 | U1.2 19.05,29.73 19.05,26.65 19.05,25.38 v23.62,20.81 | U2.2 v72.85,16.95 | v57.66,1.76 57.15,1.25 48.77,1.25 47.5,2.52 47.5,5.06 48.51,6.08 49.28,6.08 J1.4 48.77,6.33 44.45,10.65 41.91,10.65 41.4,11.16 41.4,11.86 | 41.4,11.86 U$2.10
  Bottom 0.254: J1.4 48.77,6.33 47.5,5.06 47.5,2.52 34.04,2.52 33.53,3.03 33.27,3.03 33.02,3.28 24.89,3.28 24.89,18.01 23.62,19.28 v23.62,20.81 | v72.85,16.95 v57.66,1.76
N$1
  Top 0.254: U$3.5 U$3.2
N$2
  Top 0.254: U$3.4 64.14,71.72 | 64.14,71.72 64.14,72.37 64.14,73.02 U$3.6 | 64.14,71.72 64.14,71.95 C4.1 R2.2
N$3
  Top 0.61: S6.2 79.59,40.2 77.47,40.2 | 77.47,40.2 C24.1 76.1,40.3 U4.5 72.39,40.3 72.39,41.13 63.5,41.13 62.74,40.37 61.72,40.37 59.94,42.14 59.94,50.02 58.93,51.03 28.45,51.03 25.15,51.03 21.59,54.59 19.05,54.59 18.05,53.59 J2.2 | D1.A 77.47,36.42 77.47,40.2
N$4
  Top 0.254: R3.1 C4.2 64.77,68.98 64.77,64.75 64.77,63.48 U$5.2
N$5
  Top 0.254: U$4.5 U$4.2
N$6
  Top 0.254: U$4.4 73.03,71.72 73.03,72.37 | 73.03,72.37 73.03,73.01 71.93,73.01 U$4.6 | R8.2 C9.1 73.03,71.95 73.03,72.37
N$7
  Top 0.254: R9.1 C9.2 71.12,66.44 71.12,64.75 69.85,63.48 U$5.5
N$8  (via drill 0.5)
  Top 0.61: C25.1 67.31,37.66 JP2.1 | U4.4 74.93,37.16 v74.93,36.81
  Bottom 0.61: v74.93,36.81 72.39,34.27 JP2.1
N$9
  Top 0.254: U$6.5 U$6.2
N$10
  Top 0.254: U$6.4 46.35,71.72 46.35,72.37 | 46.35,72.37 46.35,73.01 45.26,73.01 U$6.6 | R12.2 C12.1 46.35,71.95 46.35,72.37
N$11
  Top 0.254: R13.1 C12.2 46.99,68.98 46.99,63.48 U$8.2
N$12
  Top 0.61: S6.1 F1.1
N$13
  Top 0.254: U$7.5 U$7.2
N$14
  Top 0.254: U$7.4 55.24,71.72 55.24,72.37 | 55.24,72.37 55.24,73.01 54.15,73.01 U$7.6 | R16.2 C14.1 55.24,71.95 55.24,72.37
N$15
  Top 0.254: R17.1 C14.2 53.34,66.44 53.34,64.75 52.07,63.48 U$8.5
N$16
  Top 0.61: R40.2 71.09,37.69 U4.3
N$17
  Top 0.254: U$9.5 U$9.2
N$18
  Top 0.254: U$9.4 28.57,71.72 28.57,72.37 | 28.57,72.37 28.57,73.01 27.48,73.01 U$9.6 | R20.2 C16.1 28.57,71.95 28.57,72.37
N$19
  Top 0.254: R21.1 C16.2 29.21,68.98 29.21,63.48 U$11.2
N$20
  Top 0.61: D1.C 76.17,33.42 R40.1
N$21
  Top 0.254: R43.2 63.5,51.9 Q1.1
N$22  (via drill 0.6)
  Top 0.305: JP4.D+1 6.35,36.81 6.99,36.17 | 6.99,36.17 7.62,35.54 C28.1 | v7.11,36.56 7.11,36.3 6.99,36.17 | v6.86,40.62 8.04,40.62 R44.2
  Bottom 0.305: v6.86,40.62 6.86,36.81 v7.11,36.56
N$23
  Top 0.305: JP4.D-1 7.42,37.46 R45.2 8.29,36.48 C29.1
N$24
  Top 0.254: U$10.5 U$10.2
N$25
  Top 0.254: U$10.4 37.47,71.72 37.47,72.37 | 37.47,72.37 37.47,73.01 36.37,73.01 U$10.6 | R24.2 C18.1 37.47,71.95 37.47,72.37
N$26
  Top 0.254: JP1.D-1 41.26,5.71 40.89,6.33 40.89,6.84 39.97,6.84 R5.1 38.7,5.57 37.34,5.57 36.16,6.75 Z2.2
N$27
  Top 0.254: Z1.2 R6.1 JP1.D+1
N$28
  Top 0.254: R25.1 C18.2 35.56,66.44 35.56,64.75 34.29,63.48 U$11.5
N$29  (via drill 0.5)
  Top 0.254: Q1.3 v64.77,58.4
  Bottom 0.254: v64.77,58.4 64.77,74.91 57.15,82.53 48.27,82.53 U3.16
N$30
  Top 0.254: U$12.5 U$12.2
N$31
  Top 0.254: U$12.4 10.79,71.72 10.79,72.37 | 10.79,72.37 10.79,73.02 U$12.6 | R28.2 C20.1 10.79,71.95 10.79,72.37
N$32
  Top 0.254: R29.1 C20.2 11.43,68.98 11.43,63.48 U$14.2
N$33
  Top 0.61: F1.2 73.69,43.32 U5.1 74.01,45.95 74.93,45.95 74.93,47.73 74.93,47.92 U5.3
N$34
  Top 0.254: U$13.5 U$13.2
N$35
  Top 0.254: U$13.4 19.68,71.72 19.68,72.37 | 19.68,72.37 19.68,73.01 18.59,73.01 U$13.6 | R32.2 C22.1 19.68,71.95 19.68,72.37
N$36
  Top 0.254: R33.1 C22.2 17.78,66.44 17.78,64.75 16.51,63.48 U$14.5
N$37
  Top 0.305: R44.1 10.57,40.94 U6.11
N$38
  Top 0.305: R45.1 11.43,39.77 11.43,40.11 11.62,40.3 U6.12
N$39  (via drill 0.5)
  Top 0.406: R42.2 R41.1 8.89,51.2 v8.89,67.29
  Bottom 0.406: v8.89,67.29 12.7,71.1 12.7,78.72 14.99,81.01 U3.3
N$40
  Top 0.254: U6.13 U6.14 14.29,39.03 14.61,38.71 15.24,38.08 16.83,36.49 U6.3
  Top 0.305: C3.1 14.61,32.96 14.61,38.71
PD5
  Top 0.254: U$1.22 43,21.76 U$2.22
PE2/!HWB
  Top 0.254: U$1.33 34.1,22.66 U$2.33
SCK  (via drill 0.5)
  Top 0.254: U$1.9 39.62,14.34 39.62,13.7 40.5,12.82 U$2.9 40.64,11.82 40.64,10.9 40.89,10.65 41.15,10.65 41.66,10.14 44.2,10.14 45.72,8.62 v45.72,8.11 | v65.35,11.99 U2.5 | U1.5 12.01,29.88 13.97,27.92 24.89,17 24.89,3.79 v33.78,3.79 | J1.3 54.61,3.79 v57.15,3.79
  Bottom 0.254: v57.15,3.79 v65.35,11.99 | v45.72,8.11 46.48,7.6 46.74,7.6 | 46.74,7.6 50.8,7.6 J1.3 | v33.78,3.79 34.54,3.03 46.48,3.03 46.74,3.28 46.74,7.6
SHIFT_CLK  (via drill 0.5)
  Top 0.254: U$1.20 41.52,19.28 42.16,19.28 43.04,20.16 U$2.20 45.33,20.16 46.48,21.57 46.48,22.33 45.97,22.84 44.2,22.84 43.69,23.35 43.69,25.89 v44.2,26.4 | IC1.2 38.61,47.58 38.61,46.46 38.1,45.95 38.1,43.92 39.37,42.65 v39.37,41.89
  Bottom 0.254: v39.37,41.89 41.91,39.35 41.91,34.27 42.67,33.51 42.67,27.92 v44.2,26.4
SHIFT_OUT  (via drill 0.5)
  Top 0.254: U$1.21 41.53,19.79 41.91,19.79 43.08,20.96 U$2.21 44.86,20.96 v45.47,21.57 | IC1.9 46.89,53.32 v49.53,53.32
  Bottom 0.254: v49.53,53.32 49.53,49.51 50.8,48.24 50.8,36.81 49.53,35.54 48.26,35.54 45.47,33 44.96,32.49 44.96,30.71 45.72,29.95 45.72,27.16 45.72,21.82 v45.47,21.57
SHIFT_SH  (via drill 0.5)
  Top 0.254: U$1.19 41.52,18.78 42.42,18.78 43,19.36 | 43,19.36 U$2.19 | 43,19.36 45.8,19.36 v46.99,20.81 | v46.23,31.73 44.45,31.73 41.15,35.03 41.15,35.79 40.39,36.56 38.35,36.56 38.1,36.81 37.47,37.45 IC1.1
  Bottom 0.254: v46.23,31.73 46.99,30.97 v46.99,20.81
UCAP
  Top 0.254: U$1.6 U$2.6 38.1,8.45 C11.1
VUSB  (via drill 0.5)
  Top 0.254: U$2.7 38.9,12.64 38.61,12.93 U$1.7 38.6,14.97 38.35,15.22 38.1,15.22 36.32,15.22 36.07,14.97 36.07,14.39 U$1.2 36.07,14.33 36.07,13.95 34.9,12.78 U$2.2 34.9,10.75 33.02,8.87 33.02,5.82 33.27,5.57 36.58,5.57 37.59,4.55 v37.85,4.55 | U4.1 71.02,40.37 64.01,40.37 57.15,33.51 v57.15,11.41 | JP1.VBUS1 40.64,4.74 40.64,5.82 39.62,5.82 38.35,4.55 38.1,4.55 | 38.1,4.55 v37.85,4.55 | v37.85,4.55 38.1,4.55
  Bottom 0.254: v57.15,11.41 47.24,11.41 45.72,9.89 45.21,9.89 41.4,6.08 38.61,6.08 37.85,5.31 v37.85,4.55
XTAL1
  Top 0.254: U$1.17 U$2.17 46.99,17.76 49.53,20.3 Y1.1 48.68,25.98 C7.1
XTAL2
  Top 0.254: U$1.16 42.93,17.25 43.22,16.96 U$2.16 48.04,16.96 Y1.2 49.7,13.86 C8.1

### Text on the board
tNames: NSA AWAY | REV 1
Reference: RNG Array | Display | Interface | SD card A | SD card B | Microcontroller | Micro USB